# Altium schematic sheet LCD.SchDoc
size A2
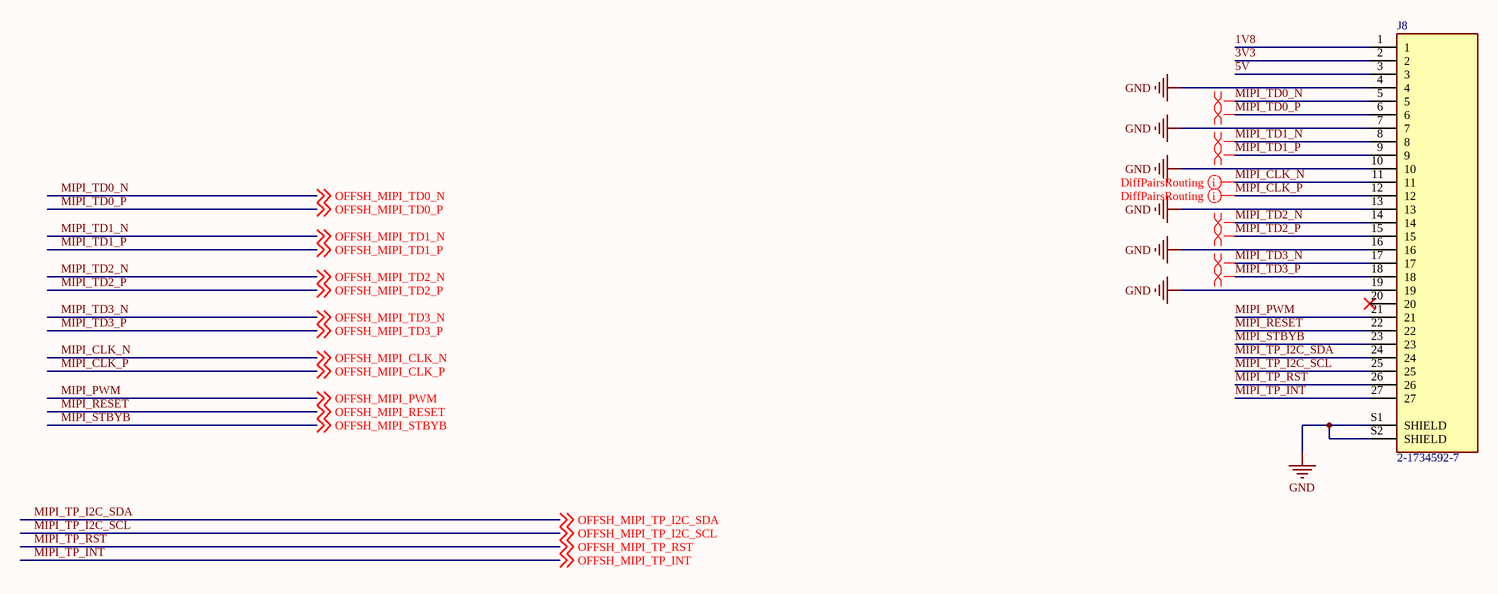
[diagram p0: LCD.SchDoc]

## Parts
J8  2-1734592-7  [TE_2-1734592-7]

## Nets
GND: J8.4 J8.7 J8.10 J8.13 J8.16 J8.19 J8.S1(SHIELD) J8.S2(SHIELD)
1V8: J8.1
3V3: J8.2
5V: J8.3
MIPI_CLK_N: J8.11 ; off-sheet OFFSH_MIPI_CLK_N  [also labelled OFFSH_MIPI_CLK_N]
MIPI_CLK_P: J8.12 ; off-sheet OFFSH_MIPI_CLK_P  [also labelled OFFSH_MIPI_CLK_P]
MIPI_PWM: J8.21 ; off-sheet OFFSH_MIPI_PWM  [also labelled OFFSH_MIPI_PWM]
MIPI_RESET: J8.22 ; off-sheet OFFSH_MIPI_RESET  [also labelled OFFSH_MIPI_RESET]
MIPI_STBYB: J8.23 ; off-sheet OFFSH_MIPI_STBYB  [also labelled OFFSH_MIPI_STBYB]
MIPI_TD0_N: J8.5 ; off-sheet OFFSH_MIPI_TD0_N  [also labelled OFFSH_MIPI_TD0_N]
MIPI_TD0_P: J8.6 ; off-sheet OFFSH_MIPI_TD0_P  [also labelled OFFSH_MIPI_TD0_P]
MIPI_TD1_N: J8.8 ; off-sheet OFFSH_MIPI_TD1_N  [also labelled OFFSH_MIPI_TD1_N]
MIPI_TD1_P: J8.9 ; off-sheet OFFSH_MIPI_TD1_P  [also labelled OFFSH_MIPI_TD1_P]
MIPI_TD2_N: J8.14 ; off-sheet OFFSH_MIPI_TD2_N  [also labelled OFFSH_MIPI_TD2_N]
MIPI_TD2_P: J8.15 ; off-sheet OFFSH_MIPI_TD2_P  [also labelled OFFSH_MIPI_TD2_P]
MIPI_TD3_N: J8.17 ; off-sheet OFFSH_MIPI_TD3_N  [also labelled OFFSH_MIPI_TD3_N]
MIPI_TD3_P: J8.18 ; off-sheet OFFSH_MIPI_TD3_P  [also labelled OFFSH_MIPI_TD3_P]
MIPI_TP_I2C_SCL: J8.25 ; off-sheet OFFSH_MIPI_TP_I2C_SCL  [also labelled OFFSH_MIPI_TP_I2C_SCL]
MIPI_TP_I2C_SDA: J8.24 ; off-sheet OFFSH_MIPI_TP_I2C_SDA  [also labelled OFFSH_MIPI_TP_I2C_SDA]
MIPI_TP_INT: J8.27 ; off-sheet OFFSH_MIPI_TP_INT  [also labelled OFFSH_MIPI_TP_INT]
MIPI_TP_RST: J8.26 ; off-sheet OFFSH_MIPI_TP_RST  [also labelled OFFSH_MIPI_TP_RST]

Not connected (* = marked no-connect by the designer): J8 20*

## Layout directives
differential pair: MIPI_CLK_N, MIPI_CLK_P, MIPI_TD0_N, MIPI_TD0_P, MIPI_TD1_N, MIPI_TD1_P, MIPI_TD2_N, MIPI_TD2_P, MIPI_TD3_N, MIPI_TD3_P

## Library data of the parts
J8 = 2-1734592-7: Package: None; Price: None; Value: *; MP: 2-1734592-7; Availability: Unavailable